# EAGLE design pub (EAGLE 6.6.0)
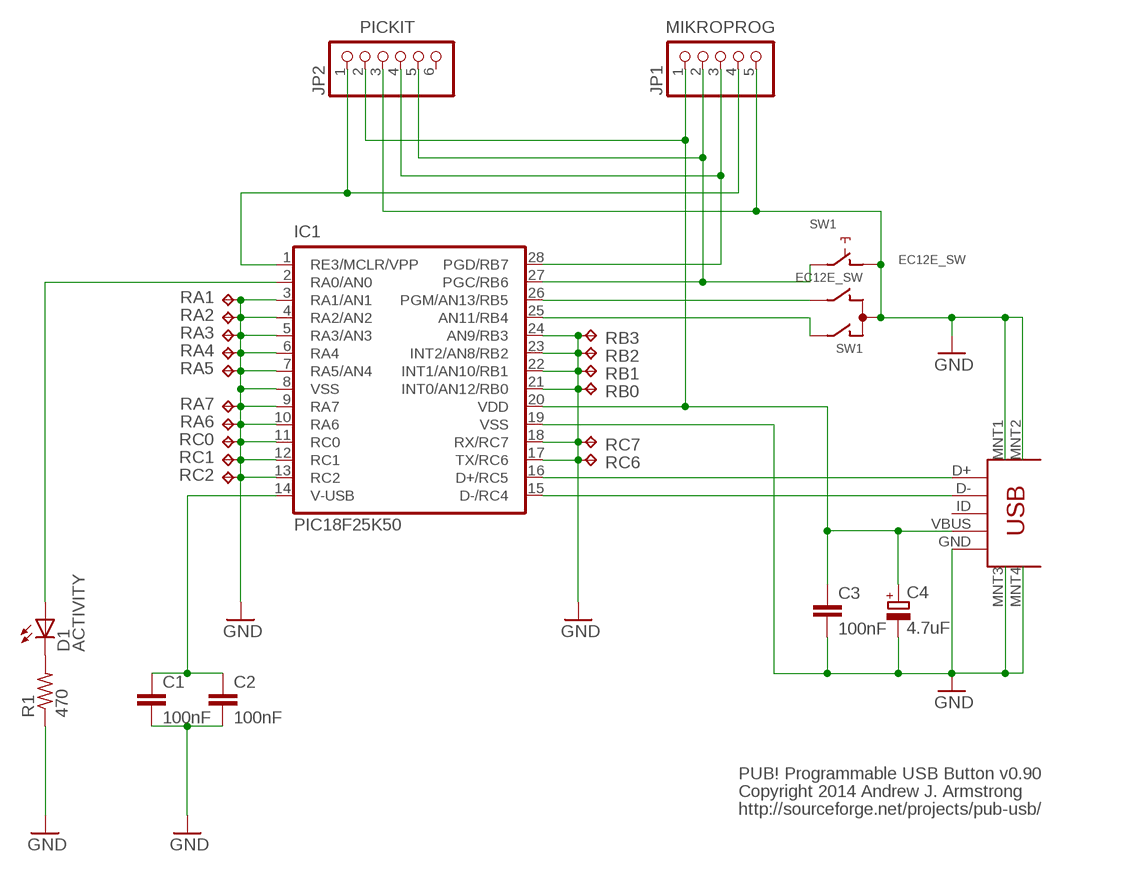
[diagram p0: schematic, sheet 1]

## Parts
C1  100nF  C-EUC0805  [C0805]
C2  100nF  C-EUC0805  [C0805]
C3  100nF  C-EUC0805  [C0805]
C4  4.7uF  CPOL-EUSMCA  [SMC_A]
D1  ACTIVITY  LEDSML1206  [SML1206]
IC1  PIC18F25K50  PIC18F25K50SO28W  [SO28W]
JP1  MIKROPROG  PINHD-1X5/90  [1X05/90]
JP2  PICKIT  PINHD-1X6/90  [1X06/90]
JP3  USB-MINIB-5PIN  [USB-MINIB]
R1  470  R-US_M1206  [M1206]
RA1  TPB1,27  [B1,27]
RA2  TPB1,27  [B1,27]
RA3  TPB1,27  [B1,27]
RA4  TPB1,27  [B1,27]
RA5  TPB1,27  [B1,27]
RA6  TPB1,27  [B1,27]
RA7  TPB1,27  [B1,27]
RB0  TPB1,27  [B1,27]
RB1  TPB1,27  [B1,27]
RB2  TPB1,27  [B1,27]
RB3  TPB1,27  [B1,27]
RC0  TPB1,27  [B1,27]
RC1  TPB1,27  [B1,27]
RC2  TPB1,27  [B1,27]
RC6  TPB1,27  [B1,27]
RC7  TPB1,27  [B1,27]
SW1  EC12E_SW  [ALPS_EC12E_SW]

## Nets
GND: C1.2 C2.2 C3.2 C4.- IC1.3(RA1/AN1) IC1.4(RA2/AN2) IC1.5(RA3/AN3) IC1.6(RA4) IC1.7(RA5/AN4) IC1.8(VSS) IC1.9(RA7) IC1.10(RA6) IC1.11(RC0) IC1.12(RC1) IC1.13(RC2) IC1.17(TX/RC6) IC1.18(RX/RC7) IC1.19(VSS) IC1.21(INT0/AN12/RB0) IC1.22(INT1/AN10/RB1) IC1.23(INT2/AN8/RB2) IC1.24(AN9/RB3) JP1.5 JP2.3 JP3.GND JP3.MNT1 JP3.MNT2 JP3.MNT3 JP3.MNT4 R1.1 RA1.TP RA2.TP RA3.TP RA4.TP RA5.TP RA6.TP RA7.TP RB0.TP RB1.TP RB2.TP RB3.TP RC0.TP RC1.TP RC2.TP RC6.TP RC7.TP SW1.C SW1.D
N$1: IC1.26(PGM/AN13/RB5) SW1.B
N$2: IC1.25(AN11/RB4) SW1.A
N$3: C1.1 C2.1 IC1.14(V-USB)
N$4: D1.A IC1.2(RA0/AN0)
N$5: IC1.16(D+/RC5) JP3.D+
N$6: IC1.15(D-/RC4) JP3.D-
N$7: C3.1 C4.+ IC1.20(VDD) JP1.1 JP2.2 JP3.VBUS
N$8: IC1.27(PGC/RB6) JP1.2 JP2.5 SW1.E
N$9: IC1.28(PGD/RB7) JP1.3 JP2.4
N$10: IC1.1(RE3/MCLR/VPP) JP1.4 JP2.1
N$20: D1.C R1.2
Unconnected: JP2.6 JP3.ID SW1.GND1(G) SW1.GND2(G)

## Notes on the sheet
- PUB! Programmable USB Button v0.90
- Copyright 2014 Andrew J. Armstrong
- http://sourceforge.net/projects/pub-usb/

## Library data of the parts
C1-C3 = rcl:C-EU: CAPACITOR, European symbol
C4 = rcl:CPOL-EU: POLARIZED CAPACITOR, European symbol
D1 = led:LED: LED OSRAM: - CHIPLED LG R971, LG N971, LY N971, LG Q971, LY Q971, LO R971, LY R971 LH N974, LH R974 LS Q976, LO Q976, LY Q976 LO Q996 - Hyper CHIPLED LW Q18S LB Q993, LB Q99A, LB R99A - SideLED LS A670, LO A670, LY A670, LG A670, LP A670 LB A673, LV A673, LT A673, LW A673 LH A674 LY A675 LS A676, LA A676, LO A676, LY A676, LW A676 LS A679, LY A679, LG A679 - Hyper Micro SIDELED® LS Y876, LA Y876, LO Y876, LY Y876 LT Y87S - SmartLED LW L88C, LW L88S LB L89C, LB L89S, LG L890 LS L89K, LO L89K, LY L89K LS L896, LA L896, LO L896, LY L896 - TOPLED LS T670, LO T670, LY T670, LG T670, LP T670 LSG T670, LSP T670, LSY T670, LOP T670, LYG T670 LG T671, LOG T671, LSG T671 LB T673, LV T673, LT T673, LW T673 LH T674 LS T676, LA T676, LO T676, LY T676, LB T676, LH T676, LSB T676, LW T676 LB T67C, LV T67C, LT T67C, LS T67K, LO T67K, LY T67K, LW E67C LS E67B, LA E67B, LO E67B, LY E67B, LB E67C, LV E67C, LT E67C LW T67C LS T679, LY T679, LG T679 LS T770, LO T770, LY T770, LG T770, LP T770 LB T773, LV T773, LT T773, LW T773 LH T774 LS E675, LA E675, LY E675, LS T675 LS T776, LA T776, LO T776, LY T776, LB T776 LHGB T686 LT T68C, LB T68C - Hyper Mini TOPLED® LB M676 - Mini TOPLED Santana® LG M470 LS M47K, LO M47K, LY M47K Source: http://www.osram.convergy.de LUXEON: - LUMILED® LXK2-PW12-R00, LXK2-PW12-S00, LXK2-PW14-U00, LXK2-PW14-V00 LXK2-PM12-R00, LXK2-PM12-S00, LXK2-PM14-U00 LXK2-PE12-Q00, LXK2-PE12-R00, LXK2-PE12-S00, LXK2-PE14-T00, LXK2-PE14-U00 LXK2-PB12-K00, LXK2-PB12-L00, LXK2-PB12-M00, LXK2-PB14-N00, LXK2-PB14-P00, LXK2-PB14-Q00 LXK2-PR12-L00, LXK2-PR12-M00, LXK2-PR14-Q00, LXK2-PR14-R00 LXK2-PD12-Q00, LXK2-PD12-R00, LXK2-PD12-S00 LXK2-PH12-R00, LXK2-PH12-S00 LXK2-PL12-P00, LXK2-PL12-Q00, LXK2-PL12-R00 Source: www.luxeon.com KINGBRIGHT: KA-3528ASYC Source: www.kingbright.com
IC1 = pub:PIC18F25K50: PIC18F25K50
JP1 = pub:PINHD-1X5: PIN HEADER
JP2 = pub:PINHD-1X6: PIN HEADER
JP3 = pub:USB-MINIB: Mini-USB Type B socket; RSCOMPONENTS: 6702654
R1 = rcl:R-US_: RESISTOR, American symbol
RA1-RA7 RB0 RB1-RB3 RC0 RC1 RC2 RC6 RC7 = testpad:TP: Test pad
SW1 = switch-alps:EC12E_SW: ALPS rotary Encoder EC12E series with switch; MPN: EC12E2424407; OC_FARNELL: 1520813; OC_NEWARK: 74M1068

## Board
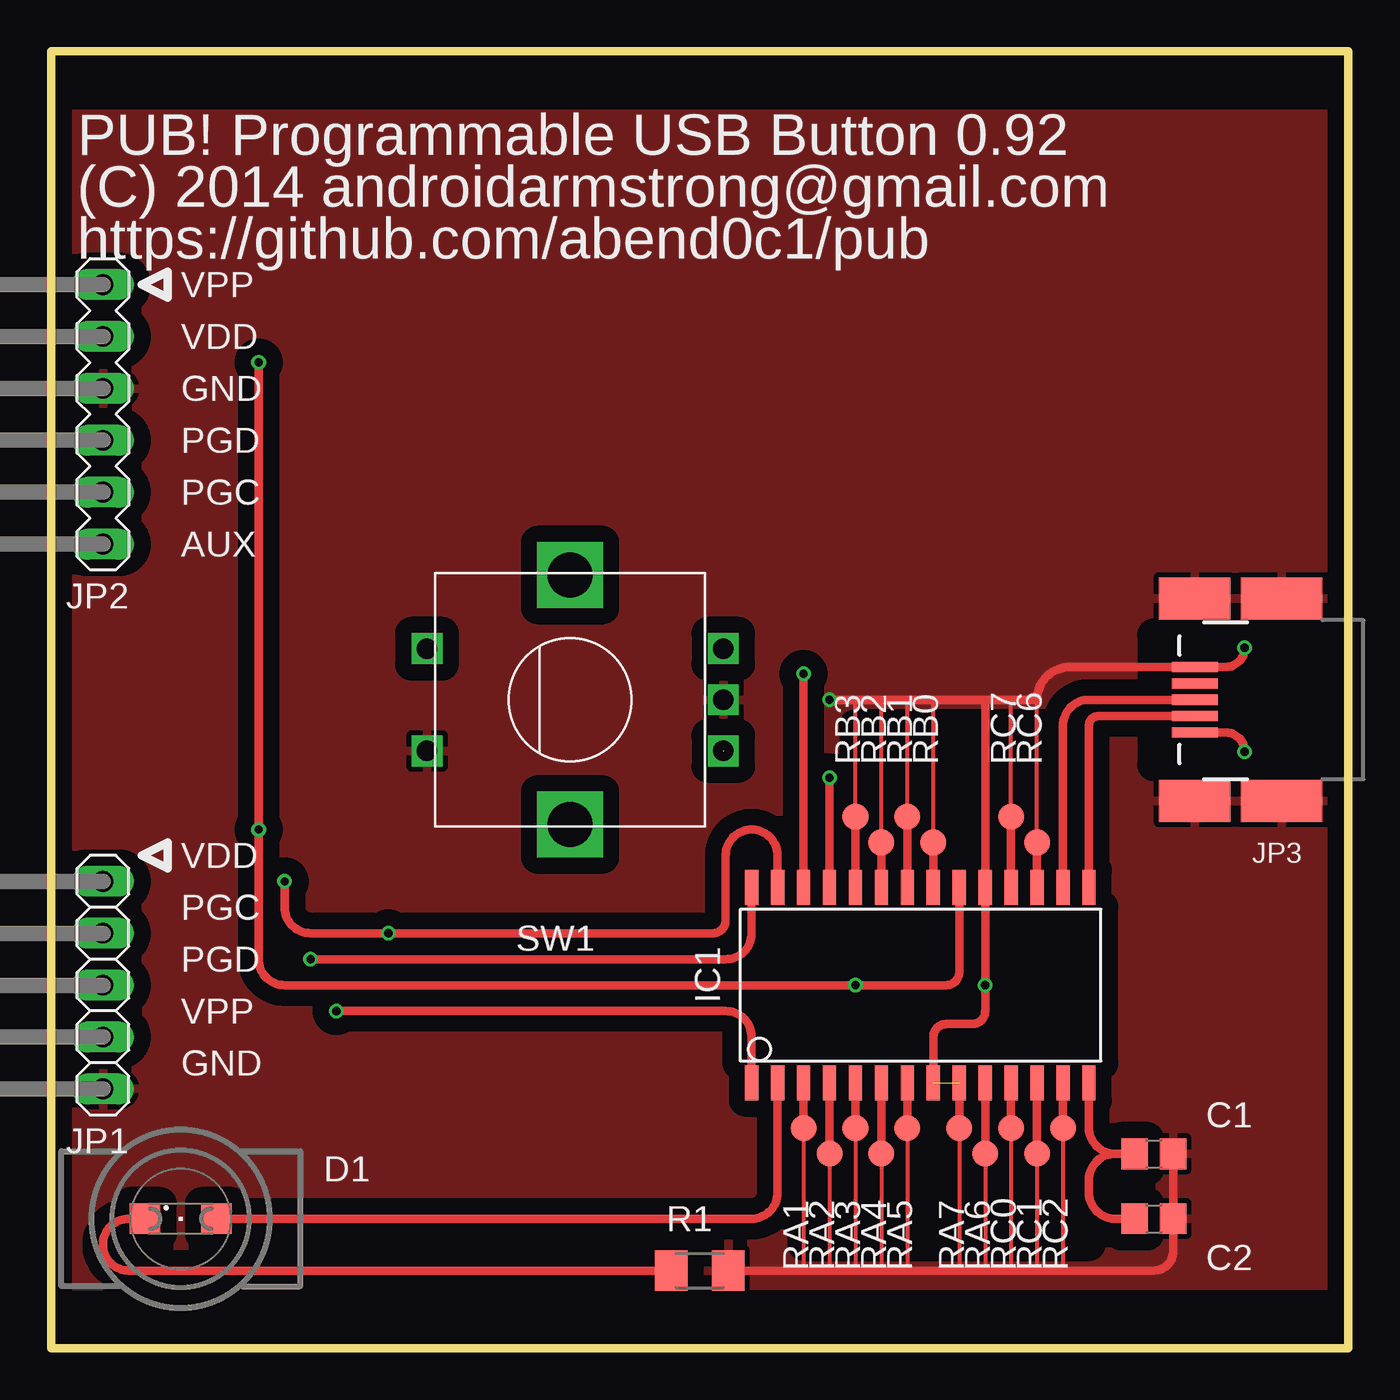
[diagram p1: board, top side]
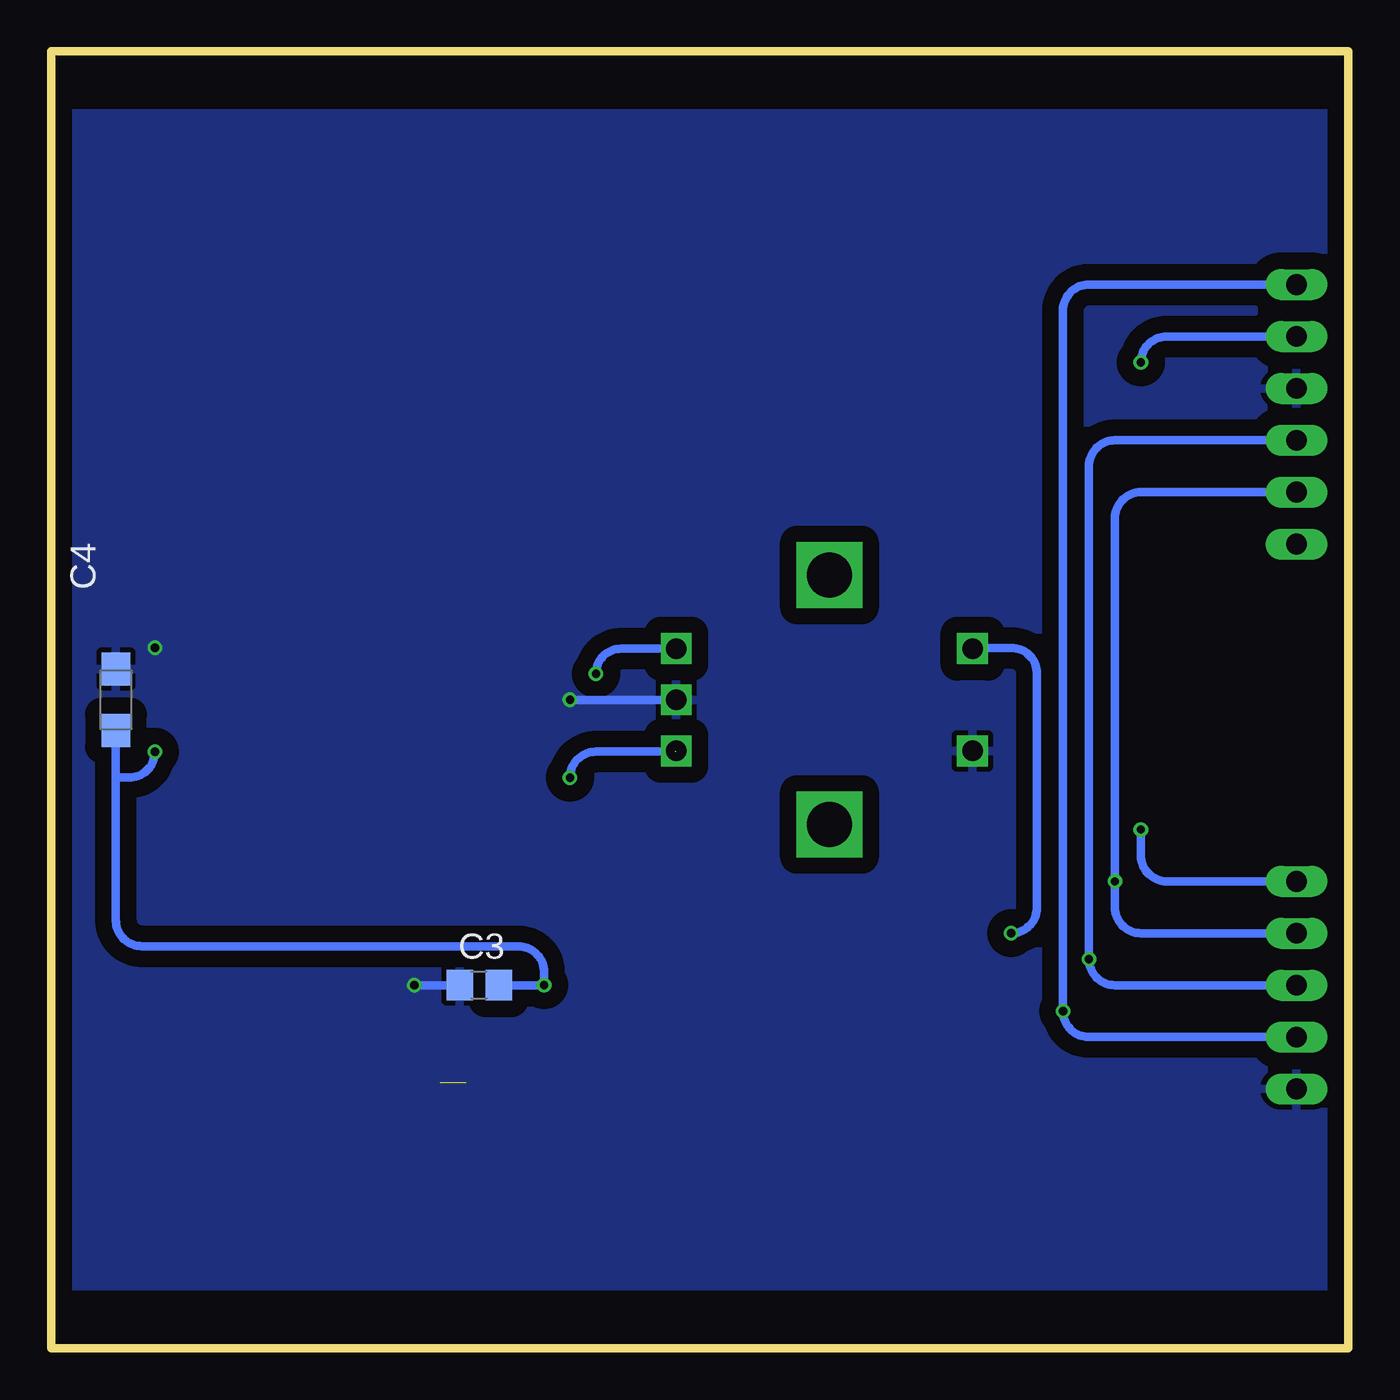
[diagram p2: board, bottom side, seen from below]

Size 63.5 x 63.5 mm. Coordinates in mm from the lower left corner, seen from the top.
Outline: 0,0 63.5,0 63.5,63.5 0,63.5 0,0
Copper layers (1*16): Top 0.035mm / dielectric 1.5mm / Bottom 0.035mm
Design rules "ITEADstudio_DRC": minimum track width 6mil, minimum drill 12mil, track to track 6mil, track to pad 6mil, pad to pad 6mil, via to via 6mil, smd to smd 0mil, copper to edge 10mil, drill to drill 10mil, minimum pad ring 10mil, minimum via ring 6mil, stop-mask expansion 2mil, vias tented up to drill 100mil, thermal gap 10mil
tRestrict: area 0,0 to 63.5,2; area 0,61.5 to 63.5,63.5; area 39.4,21.6 to 50.8,30.5; area 33.7,14 to 51.4,21.6; area 54,28.6 to 61,34.9; area 36.8,5.1 to 50.8,14
bRestrict: area 0,61.5 to 63.5,63.5; area 0,0 to 63.5,2

### Footprints (pad centres in the part's own frame; a part is rotated, then mirrored left to right if it is on the bottom)
C0805 = smd 1.3 x 1.5: 1 -0.95,0; 2 0.95,0
SMC_A = smd 1.6 x 1.4: + -1.5,0; - 1.5,0
SML1206 = smd 1.5 x 1.5: A 1.75,0; C -1.75,0
SO28W = smd 0.65 x 1.7: 1 -7.62,-4.78; 2 -6.35,-4.78; 3 -5.08,-4.78; 4 -3.81,-4.78; 5 -2.54,-4.78; 6 -1.27,-4.78; 7 0,-4.78; 8 1.27,-4.78; 9 2.54,-4.78; 10 3.81,-4.78; 11 5.08,-4.78; 12 6.35,-4.78; 13 7.62,-4.78; 14 8.89,-4.78; 15 8.89,4.78; 16 7.62,4.78; 17 6.35,4.78; 18 5.08,4.78; 19 3.81,4.78; 20 2.54,4.78; 21 1.27,4.78; 22 0,4.78; 23 -1.27,4.78; 24 -2.54,4.78; 25 -3.81,4.78; 26 -5.08,4.78; 27 -6.35,4.78; 28 -7.62,4.78
1X05/90 = drill 1.016 long: 1 5.08,0; 2 2.54,0; 3 0,0; 4 -2.54,0; 5 -5.08,0
1X06/90 = drill 1.016 long: 1 6.35,0; 2 3.81,0; 3 1.27,0; 4 -1.27,0; 5 -3.81,0; 6 -6.35,0
USB-MINIB = smd 2.25 x 0.5: D+ 6.25,0; D- 6.25,0.8; GND 6.25,-1.6; ID 6.25,-0.8; VBUS 6.25,1.6 | smd 4 x 2.05: MNT1 2,4.95; MNT3 2,-4.95 | smd 3.5 x 2.05: MNT2 6.25,4.95; MNT4 6.25,-4.95
M1206 = smd 1.6 x 2: 1 -1.4,0; 2 1.4,0
B1,27 = smd 1.27 x 1.27: TP 0,0
ALPS_EC12E_SW = drill 1 square: A -2.5,-7.5; B 2.5,-7.5; C 0,-7.5; D -2.5,7; E 2.5,7 | drill 2.2 square: GND1 -6.1,0; GND2 6.1,0

### Placement (x,y rotation side)
C1  53.98,9.53 0 top
C2  53.98,6.35 0 top
C3  42.55,17.78 180 bottom
C4  60.33,31.75 90 bottom
D1  6.35,6.35 0 top
IC1  41.91,17.78 0 top
JP1  2.54,17.78 90 top
JP2  2.54,45.72 90 top
JP3  62.23,31.75 180 top
R1  31.75,3.81 180 top
RA1  36.83,10.79 0 top
RA2  38.1,9.53 0 top
RA3  39.37,10.79 0 top
RA4  40.64,9.53 0 top
RA5  41.91,10.79 0 top
RA6  45.72,9.53 0 top
RA7  44.45,10.79 0 top
RB0  43.18,24.77 0 top
RB1  41.91,26.04 0 top
RB2  40.64,24.77 0 top
RB3  39.37,26.04 90 top
RC0  46.99,10.79 0 top
RC1  48.26,9.53 0 top
RC2  49.53,10.79 0 top
RC6  48.26,24.77 0 top
RC7  46.99,26.04 0 top
SW1  25.4,31.75 90 top
U$1  [LIGHTGUIDE]  6.35,6.35 0 top

### Tracks (layer width: path | path; a pad name or v marks a point on that pad's centre or on a via)
GND  (via drill 0.41)  (1 unrouted)
  Top 0.203: IC1.3 36.83,3.81 | IC1.4 38.1,3.81 | IC1.5 39.37,3.81 | IC1.6 40.64,3.81 | IC1.7 41.91,3.81 | IC1.9 44.45,3.81 | IC1.10 45.72,3.81 | IC1.11 46.99,3.81 | IC1.12 48.26,3.81 | 49.53,12.7 49.53,3.81 | IC1.23 40.64,31.75 | IC1.22 41.91,31.75 | IC1.21 43.18,31.75 | IC1.17 48.26,31.75 | IC1.18 46.99,31.75 | IC1.24 39.37,31.75
  Top 0.406: IC1.13 49.53,12.7 RC2.TP | IC1.12 RC1.TP | IC1.11 RC0.TP | IC1.10 RA6.TP | IC1.9 RA7.TP | IC1.7 RA5.TP | IC1.6 RA4.TP | IC1.5 RA3.TP | IC1.4 RA2.TP | IC1.3 RA1.TP | IC1.17 RC6.TP | IC1.18 RC7.TP | IC1.21 RB0.TP | IC1.22 RB1.TP | IC1.23 RB2.TP | 45.72,31.75 IC1.19 v45.72,17.78 45.72,16.51 arc-90 45.09,15.88 43.81,15.88 arc90 43.18,15.24 IC1.8 | v58.42,34.29 arc-90 57.48,33.35 JP3.GND 49.86,33.35 arc90 48.26,31.75 39.37,31.75 v38.1,31.75 | R1.1 36.83,3.81 44.45,3.81 45.72,3.81 46.99,3.81 48.26,3.81 49.53,3.81 53.98,3.81 arc90 54.92,4.76 C2.2 C1.2 | IC1.24 RB3.TP
  Bottom 0.406: C3.2 v45.72,17.78 | v38.1,31.75 SW1.C
  pour Bottom (isolate 0.813): 0,63.5 0,0 63.5,0 63.5,63.5
  pour Top (isolate 0.813): 0,63.5 63.5,63.5 63.5,0 0,0
N$1  (via drill 0.41)
  Top 0.406: IC1.26 v36.83,33.02
  Bottom 0.406: SW1.B 35.6,34.25 arc-90 v36.83,33.02
N$2  (via drill 0.41)  (1 unrouted)
  Top 0.406: v38.1,27.94 IC1.25
  Bottom 0.406: 32.94,29.21 36.83,29.21 arc-90 v38.1,27.94
N$3
  Top 0.406: IC1.14 50.8,10.79 arc90 52.07,9.53 | 52.07,9.53 C1.1 | C2.1 52.07,6.35 arc-90 50.8,7.62 50.8,8.26 arc-90 52.07,9.53
N$4
  Top 0.406: IC1.2 35.56,7.62 arc-90 34.29,6.35 D1.A
N$5
  Top 0.406: IC1.16 49.53,30.48 arc-90 50.8,31.75 JP3.D+
N$6
  Top 0.406: IC1.15 50.8,30.48 arc-90 51.27,30.95 JP3.D-
N$7  (via drill 0.41)
  Top 0.406: JP3.VBUS 57.48,30.15 arc-90 v58.42,29.21 | v10.16,48.26 v10.16,25.4 10.16,19.05 arc90 11.43,17.78 v39.37,17.78 43.81,17.78 arc90 44.45,18.41 IC1.20
  Bottom 0.406: C3.1 v39.37,17.78 39.37,18.41 arc-90 40.64,19.68 59.05,19.68 arc90 60.33,20.95 60.33,27.94 | 60.33,27.94 C4.+ | v58.42,29.21 arc90 59.69,27.94 60.33,27.94 | JP2.2 8.89,49.53 arc-90 v10.16,48.26 | JP1.1 8.89,22.86 arc90 10.16,24.13 v10.16,25.4
N$8  (via drill 0.41)
  Top 0.406: IC1.27 35.56,24.13 arc90 34.29,25.4 arc90 33.02,24.13 33.02,20.95 arc-90 32.38,20.32 v16.51,20.32 12.7,20.32 arc-90 11.43,21.59 v11.43,22.86
  Bottom 0.406: JP2.5 10.16,41.91 arc-90 11.43,40.64 v11.43,22.86 11.43,21.59 arc-90 10.16,20.32 JP1.2 | SW1.E arc90 18.36,34.29 16.51,34.29 arc90 15.24,33.02 15.24,21.59 arc90 v16.51,20.32
N$9  (via drill 0.41)
  Top 0.406: IC1.28 34.29,20.32 arc-90 33.02,19.05 v12.7,19.05
  Bottom 0.406: JP2.4 11.43,44.45 arc-90 12.7,43.18 v12.7,19.05 arc-90 11.43,17.78 JP1.3
N$10  (via drill 0.41)
  Top 0.406: IC1.1 34.29,15.24 arc90 33.02,16.51 v13.97,16.51
  Bottom 0.406: JP2.1 12.7,52.07 arc-90 13.97,50.8 v13.97,16.51 arc-90 12.7,15.24 JP1.4
N$20
  Top 0.406: D1.C 3.81,6.35 arc90 2.54,5.08 arc90 3.81,3.81 R1.2

### Text on the board
tPlace: VPP | VDD | GND | PGD | PGC | AUX | VDD | PGC | PGD | VPP | GND
_tsilk: PUB! Programmable USB Button 0.92 | (C) 2014 androidarmstrong@gmail.com | https://github.com/abend0c1/pub